# EAGLE design MotorControllerV2 (EAGLE 5.10)
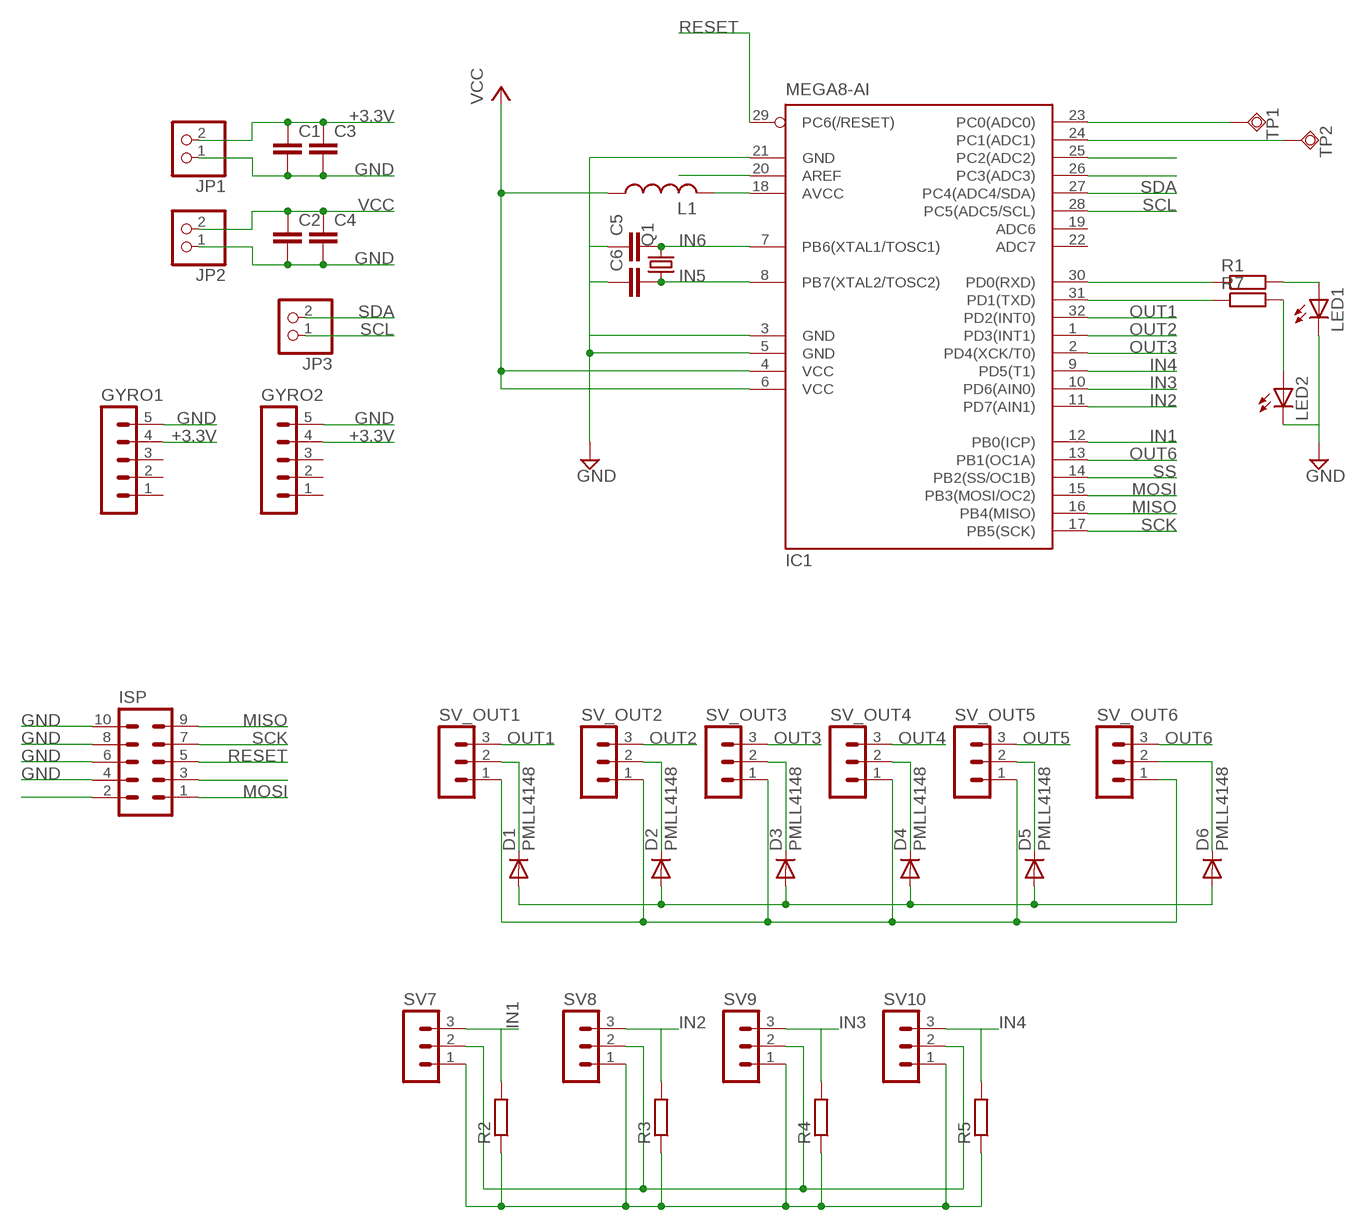
[diagram p0: schematic, sheet 1]

## Parts
C1  C-EUC0805  [C0805]
C2  C-EUC0805  [C0805]
C3  C-EUC0805  [C0805]
C4  C-EUC0805  [C0805]
C5  C-EUC0805  [C0805]
C6  C-EUC0805  [C0805]
D1  PMLL4148  DIODE-SOD80C  [SOD80C]
D2  PMLL4148  DIODE-SOD80C  [SOD80C]
D3  PMLL4148  DIODE-SOD80C  [SOD80C]
D4  PMLL4148  DIODE-SOD80C  [SOD80C]
D5  PMLL4148  DIODE-SOD80C  [SOD80C]
D6  PMLL4148  DIODE-SOD80C  [SOD80C]
GYRO1  MA05-1  [MA05-1]
GYRO2  MA05-1  [MA05-1]
IC1  MEGA8-AI  [TQFP32-08]
ISP  MA05-2  [MA05-2]
JP1  PINHD-1X2  [1X02]
JP2  PINHD-1X2  [1X02]
JP3  PINHD-1X2  [1X02]
L1  L-USL1812  [L1812]
LED1  LEDCHIPLED_0805  [CHIPLED_0805]
LED2  LEDCHIPLED_0805  [CHIPLED_0805]
Q1  CRYSTALHC49S  [HC49/S]
R1  R-EU_M0805  [M0805]
R2  R-EU_M0805  [M0805]
R3  R-EU_M0805  [M0805]
R4  R-EU_M0805  [M0805]
R5  R-EU_M0805  [M0805]
R7  R-EU_M0805  [M0805]
SV7  MA03-1  [MA03-1]
SV8  MA03-1  [MA03-1]
SV9  MA03-1  [MA03-1]
SV10  MA03-1  [MA03-1]
SV_OUT1  MA03-1  [MA03-1]
SV_OUT2  MA03-1  [MA03-1]
SV_OUT3  MA03-1  [MA03-1]
SV_OUT4  MA03-1  [MA03-1]
SV_OUT5  MA03-1  [MA03-1]
SV_OUT6  MA03-1  [MA03-1]
TP1  TPSQTP14R  [TP14R]
TP2  TPSQTP14R  [TP14R]

## Nets
+3.3V: C1.1 C3.1 GYRO1.4 GYRO2.4 JP1.2
GND: C1.2 C2.2 C3.2 C4.2 C5.1 C6.1 GYRO1.5 GYRO2.5 IC1.3(GND) IC1.21(GND) ISP.4 ISP.6 ISP.8 ISP.10 JP1.1 JP2.1 LED1.C LED2.C R2.1 R3.1 R4.1 R5.1 SV7.1 SV8.1 SV9.1 SV10.1 SV_OUT1.1 SV_OUT2.1 SV_OUT3.1 SV_OUT4.1 SV_OUT5.1 SV_OUT6.1
IN1: IC1.12(PB0(ICP)) R2.2 SV7.3
IN2: IC1.11(PD7(AIN1)) R3.2 SV8.3
IN3: IC1.10(PD6(AIN0)) R4.2 SV9.3
IN4: IC1.9(PD5(T1)) R5.2 SV10.3
IN5: C6.2 IC1.8(PB7(XTAL2/TOSC2)) Q1.1
IN6: C5.2 IC1.7(PB6(XTAL1/TOSC1)) Q1.2
MISO: IC1.16(PB4(MISO)) ISP.9
MOSI: IC1.15(PB3(MOSI/OC2)) ISP.1
N$1: IC1.23(PC0(ADC0)) TP1.TP
N$2: IC1.24(PC1(ADC1)) TP2.TP
N$3: IC1.30(PD0(RXD)) R1.1
N$4: LED1.A R1.2
N$5: D1.C SV_OUT1.2
N$6: ISP.2
N$7: D2.C SV_OUT2.2
N$8: D3.C SV_OUT3.2
N$9: D4.C SV_OUT4.2
N$10: D5.C SV_OUT5.2
N$11: D6.C SV_OUT6.2
N$12: IC1.31(PD1(TXD)) R7.1
N$13: LED2.A R7.2
N$14: ISP.3
N$18: IC1.20(AREF)
N$19: IC1.18(AVCC) L1.2
OUT1: IC1.32(PD2(INT0)) SV_OUT1.3
OUT2: IC1.1(PD3(INT1)) SV_OUT2.3
OUT3: IC1.2(PD4(XCK/T0)) SV_OUT3.3
OUT4: IC1.26(PC3(ADC3)) SV_OUT4.3
OUT5: IC1.25(PC2(ADC2)) SV_OUT5.3
OUT6: IC1.13(PB1(OC1A)) SV_OUT6.3
RESET: IC1.29(PC6(/RESET)) ISP.5
SCK: IC1.17(PB5(SCK)) ISP.7
SCL: IC1.28(PC5(ADC5/SCL)) JP3.1
SDA: IC1.27(PC4(ADC4/SDA)) JP3.2
SS: IC1.14(PB2(SS/OC1B))
VCC: C2.1 C4.1 D1.A D2.A D3.A D4.A D5.A D6.A IC1.4(VCC) IC1.6(VCC) JP2.2 L1.1 SV7.2 SV8.2 SV9.2 SV10.2
Unconnected: GYRO1.1 GYRO1.2 GYRO1.3 GYRO2.1 GYRO2.2 GYRO2.3 IC1.19(ADC6) IC1.22(ADC7)

## Power pins joined to a net without a drawn wire
GND: IC1.5(GND)

## Library data of the parts
C1-C4 = rcl:C-EU: CAPACITOR, European symbol
C5 C6 = resistor:C-EU: CAPACITOR, European symbol
D1-D6 = diode:DIODE-: DIODE
GYRO1 GYRO2 = con-lstb:MA05-1: PIN HEADER
IC1 = atmel:MEGA8: MICROCONTROLLER 8 Kbytes FLASH, 1 kbytes SRAM, 512 bytes EEPROM, USART, 6-channel 10 bit ADC, 2-channel 8 bit ADC Pin compatible with Atmega48, ATMega88, ATMega168 Source: avr.lbr
ISP = con-lstb:MA05-2: PIN HEADER
JP1-JP3 = pinhead:PINHD-1X2: PIN HEADER
L1 = resistor:L-US: INDUCTOR, American symbol
LED1 LED2 = led:LED: LED OSRAM: - CHIPLED LG R971, LG N971, LY N971, LG Q971, LY Q971, LO R971, LY R971 LH N974, LH R974 LS Q976, LO Q976, LY Q976 LO Q996 - Hyper CHIPLED LW Q18S LB Q993, LB Q99A, LB R99A - SideLED LS A670, LO A670, LY A670, LG A670, LP A670 LB A673, LV A673, LT A673, LW A673 LH A674 LY A675 LS A676, LA A676, LO A676, LY A676, LW A676 LS A679, LY A679, LG A679 - Hyper Micro SIDELED® LS Y876, LA Y876, LO Y876, LY Y876 LT Y87S - SmartLED LW L88C, LW L88S LB L89C, LB L89S, LG L890 LS L89K, LO L89K, LY L89K LS L896, LA L896, LO L896, LY L896 - TOPLED LS T670, LO T670, LY T670, LG T670, LP T670 LSG T670, LSP T670, LSY T670, LOP T670, LYG T670 LG T671, LOG T671, LSG T671 LB T673, LV T673, LT T673, LW T673 LH T674 LS T676, LA T676, LO T676, LY T676, LB T676, LH T676, LSB T676, LW T676 LB T67C, LV T67C, LT T67C, LS T67K, LO T67K, LY T67K, LW E67C LS E67B, LA E67B, LO E67B, LY E67B, LB E67C, LV E67C, LT E67C LW T67C LS T679, LY T679, LG T679 LS T770, LO T770, LY T770, LG T770, LP T770 LB T773, LV T773, LT T773, LW T773 LH T774 LS E675, LA E675, LY E675, LS T675 LS T776, LA T776, LO T776, LY T776, LB T776 LHGB T686 LT T68C, LB T68C - Hyper Mini TOPLED® LB M676 - Mini TOPLED Santana® LG M470 LS M47K, LO M47K, LY M47K Source: http://www.osram.convergy.de LUXEON: - LUMILED® LXK2-PW12-R00, LXK2-PW12-S00, LXK2-PW14-U00, LXK2-PW14-V00 LXK2-PM12-R00, LXK2-PM12-S00, LXK2-PM14-U00 LXK2-PE12-Q00, LXK2-PE12-R00, LXK2-PE12-S00, LXK2-PE14-T00, LXK2-PE14-U00 LXK2-PB12-K00, LXK2-PB12-L00, LXK2-PB12-M00, LXK2-PB14-N00, LXK2-PB14-P00, LXK2-PB14-Q00 LXK2-PR12-L00, LXK2-PR12-M00, LXK2-PR14-Q00, LXK2-PR14-R00 LXK2-PD12-Q00, LXK2-PD12-R00, LXK2-PD12-S00 LXK2-PH12-R00, LXK2-PH12-S00 LXK2-PL12-P00, LXK2-PL12-Q00, LXK2-PL12-R00 Source: www.luxeon.com KINGBRIGHT: KA-3528ASYC Source: www.kingbright.com
Q1 = crystal:CRYSTAL: CRYSTAL
R1-R5 R7 = resistor:R-EU_: RESISTOR, European symbol
SV7-SV10 SV_OUT1-SV_OUT6 = con-lstb:MA03-1: PIN HEADER
TP1 TP2 = testpad:TPSQ: Test pad

## Board
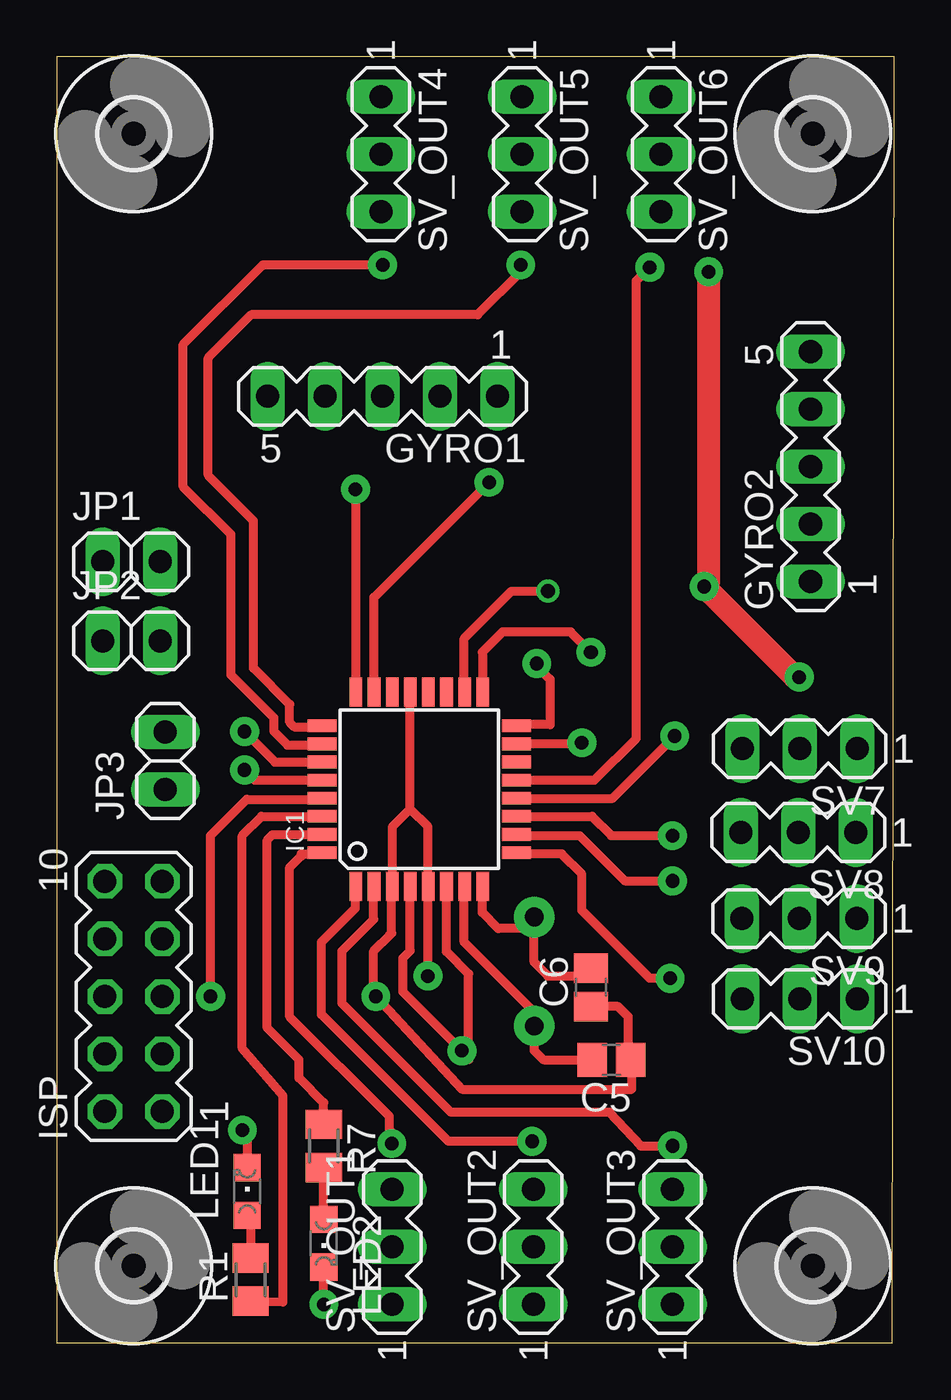
[diagram p1: board, top side]
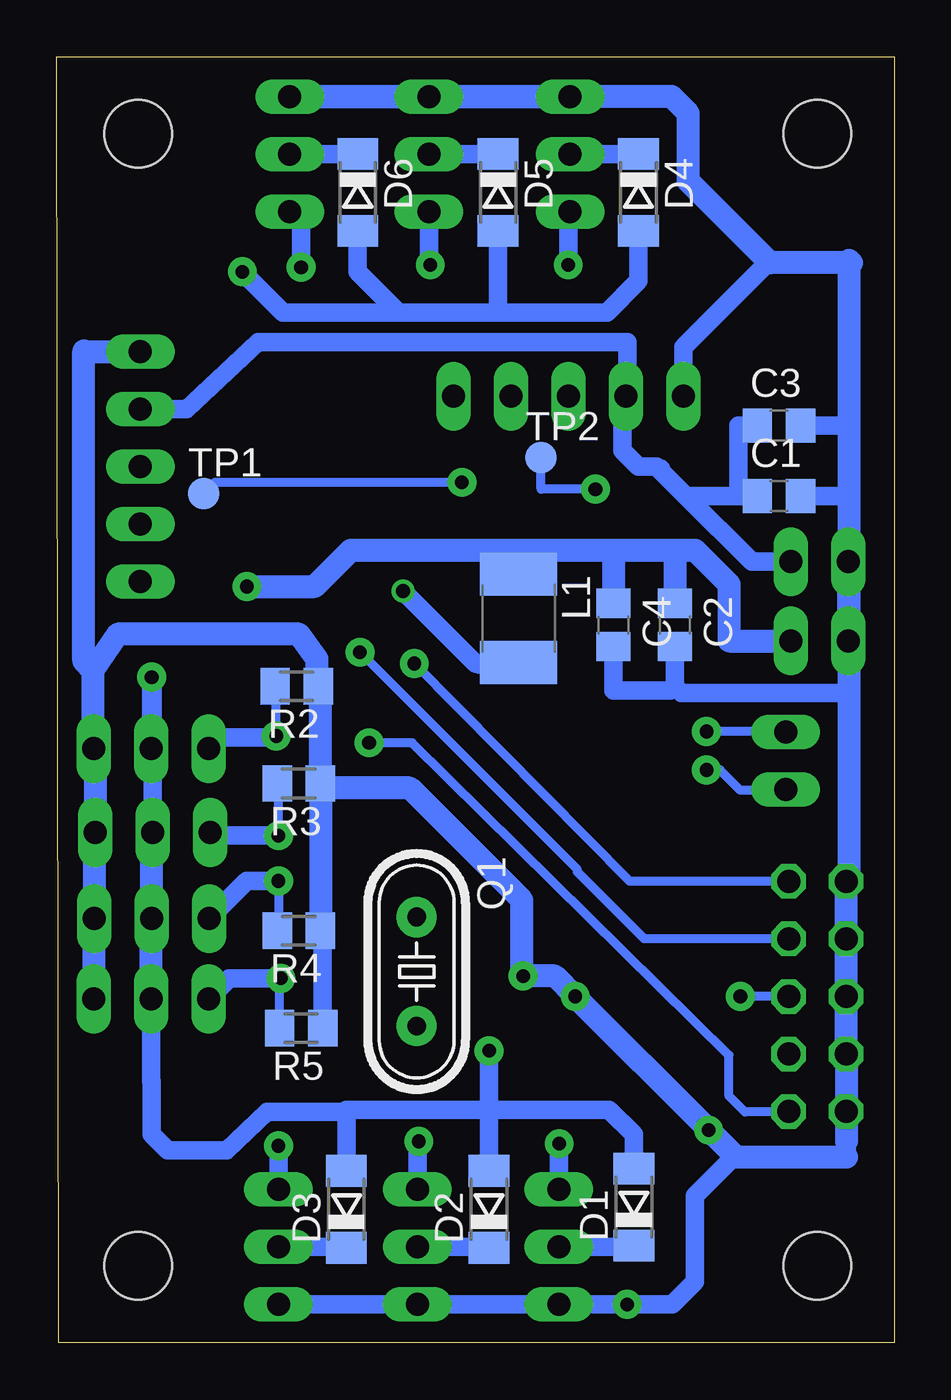
[diagram p2: board, bottom side, seen from below]

Size 37 x 56.8 mm. Coordinates in mm from the lower left corner, seen from the top.
Outline: 0,0 36.9,0 37,56.8 0,56.8 0,0
Copper layers (1*16): Top 0.035mm / dielectric 1.5mm / Bottom 0.035mm
Design rules "default": minimum track width 10mil, minimum drill 24mil, track to track 8mil, track to pad 8mil, pad to pad 8mil, via to via 8mil, smd to smd 8mil, copper to edge 40mil, drill to drill 8mil, minimum pad ring 10mil, minimum via ring 8mil, stop-mask expansion 4mil, vias tented up to drill 0mil, thermal gap 10mil

### Footprints (pad centres in the part's own frame; a part is rotated, then mirrored left to right if it is on the bottom)
C0805 = smd 1.3 x 1.5: 1 -0.95,0; 2 0.95,0
C0805' = smd 1.3 x 1.5: 1 -0.85,0; 2 0.85,0
SOD80C = smd 1.4 x 1.8: A 1.7,0; C -1.7,0
MA05-1 = drill 1.016 long: 1 -5.08,0; 2 -2.54,0; 3 0,0; 4 2.54,0; 5 5.08,0
TQFP32-08 = smd 1.27 x 0.559: 1 -4.293,2.8; 2 -4.293,2; 3 -4.293,1.2; 4 -4.293,0.4; 5 -4.293,-0.4; 6 -4.293,-1.2; 7 -4.293,-2; 8 -4.293,-2.8; 17 4.293,-2.8; 18 4.293,-2; 19 4.293,-1.2; 20 4.293,-0.4; 21 4.293,0.4; 22 4.293,1.2; 23 4.293,2; 24 4.293,2.8 | smd 0.559 x 1.27: 9 -2.8,-4.293; 10 -2,-4.293; 11 -1.2,-4.293; 12 -0.4,-4.293; 13 0.4,-4.293; 14 1.2,-4.293; 15 2,-4.293; 16 2.8,-4.293; 25 2.8,4.293; 26 2,4.293; 27 1.2,4.293; 28 0.4,4.293; 29 -0.4,4.293; 30 -1.2,4.293; 31 -2,4.293; 32 -2.8,4.293
MA05-2 = drill 1.016 octagon: 1 -5.08,-1.27; 2 -5.08,1.27; 3 -2.54,-1.27; 4 -2.54,1.27; 5 0,-1.27; 6 0,1.27; 7 2.54,-1.27; 8 2.54,1.27; 9 5.08,-1.27; 10 5.08,1.27
1X02 = drill 1.016 long: 1 -1.27,0; 2 1.27,0
L1812 = smd 1.9 x 3.4: 1 -1.95,0; 2 1.95,0
CHIPLED_0805 = smd 1.2 x 1.2: A 0,-1.05; C 0,1.05
HC49/S = drill 0.813 round: 1 -2.413,0; 2 2.413,0
M0805 = smd 1.3 x 1.6: 1 -0.95,0; 2 0.95,0
MA03-1 = drill 1.016 long: 1 -2.54,0; 2 0,0; 3 2.54,0
TP14R = smd 1.4 x 1.4: TP 0,0
3,0 = hole 3: 0,0

### Placement (x,y rotation side)
C1  5.1,37.4 0 bottom
C2  9.7,31.7 270 bottom
C3  5.1,40.5 0 bottom
C4  12.4,31.7 270 bottom
C5  [C0805']  24.5,12.5 180 top
C6  [C0805']  23.6,15.7 90 top
D1  11.5,6 90 bottom
D2  17.9,5.9 90 bottom
D3  24.2,5.9 90 bottom
D4  11.3,50.8 270 bottom
D5  17.5,50.8 270 bottom
D6  23.7,50.8 270 bottom
GYRO1  14.4,41.8 180 top
GYRO2  33.3,38.7 90 top
IC1  16.02,24.45 90 top
ISP  3.4,15.3 90 top
JP1  3.3,34.5 0 top
JP2  3.3,31 0 top
JP3  4.8,25.7 90 top
L1  16.6,32 270 bottom
LED1  8.42,6.69 0 top
LED2  11.8,4.4 180 top
Q1  21.1,16.4 270 bottom
R1  8.57,2.79 90 top
R2  26.4,29 180 bottom
R3  26.3,24.7 180 bottom
R4  26.3,18.2 180 bottom
R5  26.2,13.9 180 bottom
R7  11.8,8.7 270 top
SV7  32.82,26.24 180 top
SV8  32.76,22.54 180 top
SV9  32.8,18.74 180 top
SV10  32.82,15.19 180 top
SV_OUT1  14.82,4.24 90 top
SV_OUT2  21.06,4.24 90 top
SV_OUT3  27.2,4.24 90 top
SV_OUT4  14.32,52.49 270 top
SV_OUT5  20.56,52.49 270 top
SV_OUT6  26.7,52.49 270 top
TP1  30.5,37.5 0 bottom
TP2  15.6,39.1 0 bottom
U$1  [3,0]  3.4,3.4 0 top
U$2  [3,0]  33.4,3.4 0 top
U$3  [3,0]  33.4,53.4 0 top
U$4  [3,0]  3.4,53.4 0 top

### Tracks (layer width: path | path; a pad name or v marks a point on that pad's centre or on a via)
+3.3V
  Bottom 0.813: GYRO2.4 31.26,41.24 28.1,44.2 11.8,44.2 11.8,41.86 GYRO1.4 12,41.66 12,39.4 11.3,38.7 10.5,38.7 10.35,38.55 | JP1.2 6.3,34.5 9.2,37.4 | 10.35,38.55 10.3,38.6 | 9.2,37.4 6.9,37.4 | 9.2,37.4 10.35,38.55 | 6.9,37.4 C1.1 | 6.9,37.4 6.9,40.5 C3.1
GND  (via drill 0.6 pad 1.27)
  Top 0.406: v16.4,16.2 16.4,20.14 IC1.5 16.4,20.18 16.4,22.8 15.62,23.58 | 15.62,23.58 IC1.21 | IC1.3 14.82,22.78 15.62,23.58 | LED1.C 8.42,9.38 v8.2,9.4 | v11.8,1.7 LED2.C | v14.1,15.3 17.9,11.2 25.4,11.2 25.4,12.5 C5.1 25.25,12.6 25.25,14.4 24.8,14.85 C6.1
  Bottom 0.406: v16.4,16.2 16.45,16.25
  Bottom 0.813: R5.1 25.25,18.1 R4.1 | 25.35,28.9 R2.1 25.5,29.05 | SV_OUT3.1 SV_OUT2.1 SV_OUT1.1 v11.8,1.7 9.8,1.7 8.8,2.7 8.8,6.5 7.05,8.25 7,8.2 | 2.1,8.2 2.1,8.9 | v2.1,12.7 2.1,12.73 ISP.4 | C1.2 2,37.4 2.03,38.53 JP1.1 | 2,28.7 9.4,28.7 9.7,29 | GYRO1.5 9.32,43.98 5.55,47.75 | C3.2 2.1,40.5 2,40.4 | 9.7,29 C2.2 | C4.2 12.4,28.8 9.9,28.8 9.7,29
  Bottom 1.016: 35.3,16.03 SV10.1 35.36,19.52 SV9.1 35.34,23.1 SV8.1 35.3,26.68 SV7.1 35.4,26.78 35.4,29.7 | 35.4,29.7 34.3,31.3 26.3,31.3 25.5,30.2 25.5,29.05 | R3.1 R4.1 | R3.1 25.35,28.9 | 2.1,8.2 7,8.2 | 2.1,8.9 v2.1,10.2 v2.1,12.7 | ISP.4 ISP.6 ISP.8 ISP.10 2,20.51 2,28.7 2,37.4 2,40.4 2,47.8 1.9,47.7 5.5,47.7 5.55,47.75 9.1,51.3 9.1,54.3 9.83,55.03 SV_OUT6.1 SV_OUT5.1 SV_OUT4.1 | GYRO2.5 35.78,43.78 35.8,43.8 35.8,30.1 35.4,29.7 | 7.05,8.25 v8.2,9.4 v14.1,15.3 15,16.2 v16.4,16.2 | JP1.1 JP2.1 | 16.45,16.25 16.45,19.55 21.4,24.5 25.15,24.5 R3.1
IN1  (via drill 0.6 pad 1.27)
  Top 0.406: IC1.12 24.55,24.05 v27.3,26.8
  Bottom 0.406: 27.36,26.74 v27.3,26.8 27.3,29.35 R2.2
  Bottom 0.813: 27.36,26.74 29.78,26.74 SV7.3
IN2  (via drill 0.6 pad 1.27)
  Top 0.406: IC1.11 23.65,23.25 24.5,22.4 26.9,22.4 27.2,22.7 v27.2,22.4
  Bottom 0.406: v27.2,22.4 27.2,24.65 R3.2
  Bottom 0.813: v27.2,22.4 30.08,22.4 SV8.3
IN3  (via drill 0.6 pad 1.27)
  Top 0.406: v27.2,20.4 25.1,20.4 23.1,22.4 20.36,22.4 IC1.10
  Bottom 0.406: v27.2,20.4 27.2,18.25 R4.2
  Bottom 0.813: v27.2,20.4 28.6,20.4 SV9.3
IN4  (via drill 0.6 pad 1.27)
  Top 0.406: v27.1,16.1 26.2,16.1 23.2,19.1 23.2,20.7 22.3,21.6 20.36,21.6 IC1.9
  Bottom 0.406: R5.2 27.15,16.05 v27.11,16.09 v27.1,16.1
  Bottom 0.813: v27.11,16.09 29.38,16.09 SV10.3
IN5
  Top 0.406: IC1.8 18.8,20.14 18.8,19 19.5,18.3 21.09,18.3 | 21.09,18.3 Q1.1 | 21.09,18.3 21.09,16.81 21.7,16.2 23.35,16.2 C6.2
IN6  (via drill 0.8 pad 1.78)
  Top 0.406: IC1.7 18,20.16 18,17.7 21.1,14.6 v21.1,14 Q1.2 21.1,12.9 21.5,12.5 C5.2
MISO  (via drill 0.6 pad 1.27)
  Top 0.406: v21.2,30 21.2,29.9 21.8,29.3 21.8,27.3 20.36,27.3 IC1.16
  Bottom 0.406: ISP.9 11.68,20.38 v21.2,30
MOSI  (via drill 0.6 pad 1.27)
  Top 0.406: IC1.15 23.15,26.45 v23.2,26.5
  Bottom 0.406: v23.2,26.5 21.3,26.5 7.3,12.7 7.3,10.9 6.6,10.2 v4.7,10.2 v4.69,10.2 ISP.1
N$1  (via drill 0.6 pad 1.27)
  Top 0.406: IC1.23 14.02,32.92 v19.1,38
  Bottom 0.406: v19.1,38 30,38 TP1.TP
N$2  (via drill 0.6 pad 1.27)
  Top 0.406: IC1.24 13.22,37.68 v13.2,37.7
  Bottom 0.406: v13.2,37.7 15.6,37.7 TP2.TP
N$3
  Top 0.406: R1.1 10,1.81 10,10.9 8.2,13 8.2,22.4 9.05,23.25 IC1.30
N$4
  Top 0.406: LED1.A 8.57,5.64 R1.2
N$5
  Bottom 0.813: SV_OUT1.2 11.56,4.24 D1.C
N$7
  Bottom 0.813: SV_OUT2.2 17.94,4.24 D2.C
N$8
  Bottom 0.813: SV_OUT3.2 23.94,4.24 D3.C
N$9
  Bottom 0.813: SV_OUT4.2 D4.C
N$10
  Bottom 0.813: SV_OUT5.2 D5.C
N$11
  Bottom 0.813: SV_OUT6.2 D6.C
N$12
  Top 0.406: IC1.31 9.55,22.45 9.3,22.2 9.3,13.9 10.7,12.5 10.7,11.7 11.8,10.6 R7.1
N$13
  Top 0.406: LED2.A R7.2
N$15  (via drill 0.6 pad 1.27)
  other vias: 3.4,3.4
N$16  (via drill 0.6 pad 1.27)
  other vias: 33.4,3.4
N$17  (via drill 0.6 pad 1.27)
  other vias: 33.4,53.4
N$19  (via drill 0.6 pad 0.61)
  Top 0.406: v21.7,33.2 20.1,33.2 18,31.1 18,28.76 IC1.18
  Bottom 0.813: L1.2 18.35,29.95 18.4,30 18.5,30 v21.7,33.2
N$20  (via drill 0.6 pad 1.27)
  other vias: 4.7,12.7
N$21  (via drill 0.6 pad 1.27)
  other vias: 2.1,15.3
N$22  (via drill 0.6 pad 1.27)
  other vias: 4.7,17.9
N$23  (via drill 0.6 pad 1.27)
  other vias: 2.1,17.8
N$24  (via drill 0.6 pad 1.27)
  other vias: 4.7,20.4
N$25  (via drill 0.6 pad 1.27)
  other vias: 2.1,20.3
N$26
  Top 0.406: 14,15.6 14,17.3 14.7,18 14.8,18.1 14.8,20.3
N$27  (via drill 0.8 pad 1.78)
  other vias: 21.1,18.8
OUT1  (via drill 0.6 pad 1.27)
  Top 0.406: IC1.32 11.68,21.6 10.8,21.6 10.8,21.5 10.3,21 10.3,14.4 14.7,10 14.7,8.9 v14.8,8.8 14.8,9.3
  Bottom 0.406: 14.82,8.78 v14.8,8.8
  Bottom 0.813: SV_OUT1.3 14.82,8.78
OUT2  (via drill 0.6 pad 1.27)
  Top 0.406: 13.3,20.08 IC1.1 13.2,20.14 13.2,19.2 11.7,17.7 11.7,14.5 17.3,8.9 v21,8.9
  Bottom 0.406: 21.06,8.84 v21,8.9
  Bottom 0.813: SV_OUT2.3 21.06,8.84
OUT3  (via drill 0.6 pad 1.27)
  Top 0.406: v27.2,8.7 25.8,8.7 24.4,10.2 17.4,10.2 12.6,15 12.6,17.3 14,18.7 14,20.14 IC1.2
  Bottom 0.813: v27.2,8.7 SV_OUT3.3
OUT4  (via drill 0.6 pad 1.27)
  Top 0.406: IC1.26 11.68,26.4 10.2,26.4 9.6,27 9.6,27.6 7.7,29.5 7.7,35.7 5.6,37.8 5.6,44.1 9.1,47.6 v14.4,47.6
  Bottom 0.813: SV_OUT4.3 14.4,49.95 v14.4,47.6
OUT5  (via drill 0.6 pad 1.27)
  Top 0.406: IC1.25 11.68,27.2 10.5,27.2 10.3,27.4 10.3,28.2 8.7,29.8 8.7,36.3 6.7,38.3 6.7,43.5 8.6,45.4 18.6,45.4 20.5,47.3 v20.5,47.6
  Bottom 0.813: SV_OUT5.3 20.56,47.66 v20.5,47.6
OUT6  (via drill 0.6 pad 1.27)
  Top 0.406: IC1.13 23.75,24.85 25.6,26.7 25.6,46.9 v26.2,47.5
  Bottom 0.813: v26.2,47.5 26.2,49.45 SV_OUT6.3
RESET  (via drill 0.6 pad 1.27)
  Top 0.406: IC1.29 11.68,24 8.4,24 6.8,22.4 v6.8,15.3
  Bottom 0.406: ISP.5 v4.7,15.3 v6.8,15.3
SCK  (via drill 0.6 pad 1.27)
  Top 0.406: v23.6,30.5 22.7,31.4 19.7,31.4 18.8,30.5 18.8,28.76 IC1.17
  Bottom 0.406: ISP.7 11.04,17.84 14,20.8 14,20.9 v23.6,30.5
SCL  (via drill 0.6 pad 1.27)
  Top 0.406: IC1.28 8.75,24.85 v8.3,25.3
  Bottom 0.406: v8.3,25.3 7.7,25.3 6.8,24.4 4.83,24.4 JP3.1
SDA  (via drill 0.6 pad 1.27)
  Top 0.406: IC1.27 9.65,25.65 v8.3,27
  Bottom 0.406: v8.3,27 4.83,27 JP3.2
VCC  (via drill 0.6 pad 1.27)
  Top 0.406: IC1.4 15.62,17.32 15.3,17 15.3,15.5 v17.9,12.9 18.2,12.5 18.2,16.3 17.22,17.28 IC1.6
  Top 0.813: v32.8,29.4 32.6,29.4 | v28.6,33.4 28.8,33.6
  Top 1.016: 32.6,29.4 v28.6,33.4 | 28.8,33.6 v28.8,47.3
  Bottom 0.406: L1.1 16.6,34.8 16.8,35
  Bottom 0.813: 24.2,10.2 24.2,10.3 17.9,10.3 | 17.9,10.3 D2.A | 17.9,10.3 12.6,10.3 11.5,9.2 D1.A | 17.9,10.3 v17.9,12.9 | D4.A 11.3,46.9 12.7,45.5 17.5,45.5 | 17.5,45.5 D5.A | D6.A 23.7,47.3 21.9,45.5 | 21.9,45.5 17.5,45.5 | SV8.2 32.76,29.36 v32.8,29.4 32.82,29.38 SV7.2 | 21.9,45.5 27,45.5 v28.8,47.3 | 24.2,10.2 D3.A | 24.2,10.2 27.7,10.2 29.5,8.5 32.1,8.5 32.8,9.2 32.8,11.55 32.82,11.55 SV10.2 | 12.6,35 12.4,34.8 | 9.5,35 9.7,34.8
  Bottom 1.016: 32.76,16.03 SV10.2 32.82,19.52 SV9.2 32.8,23.1 SV8.2 | JP2.2 7.3,31 7.3,33.5 8.8,35 9.5,35 12.6,35 16.8,35 24,35 25.6,33.4 v28.6,33.4 | 12.4,34.8 C4.1 | 9.7,34.8 C2.1